# Altium project PCB_Smart_Garden.PrjPcb
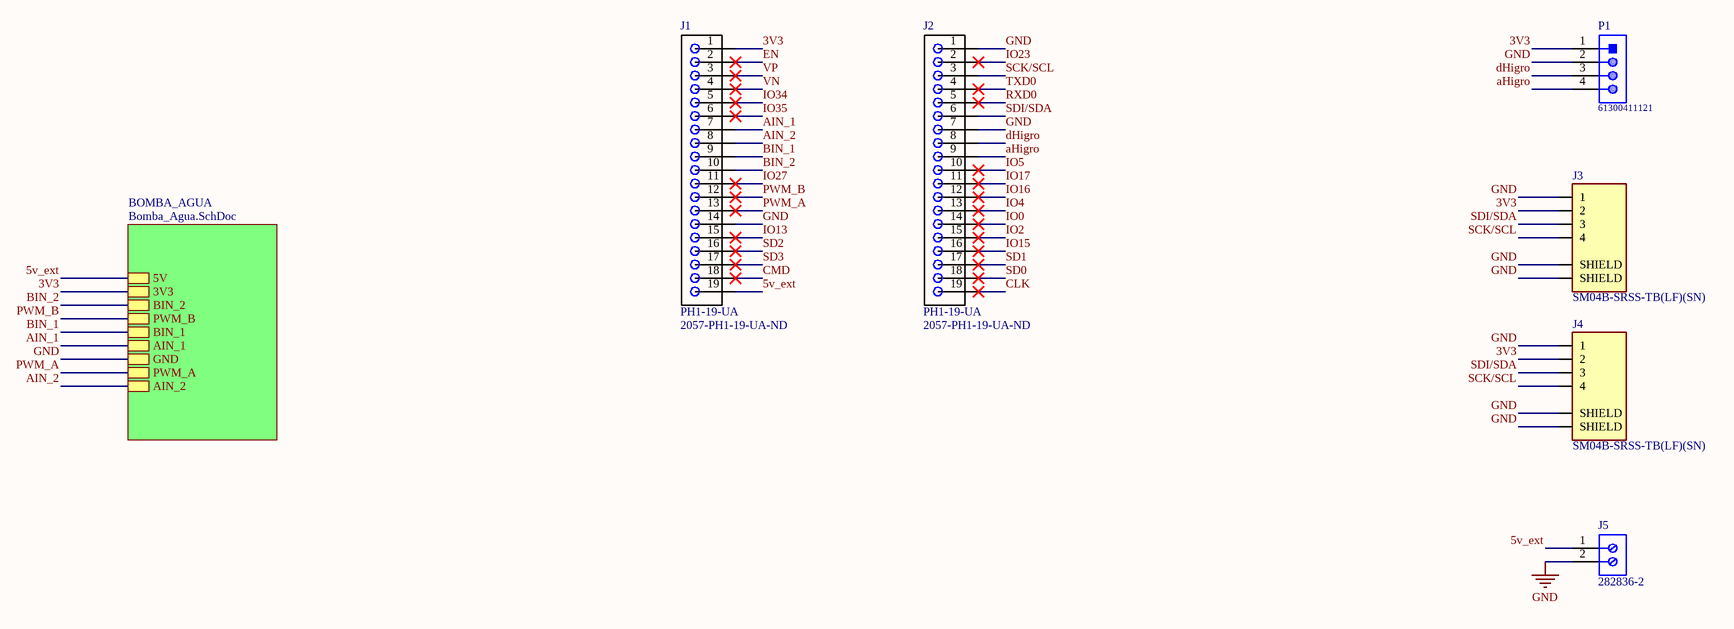
[diagram p0: SM_Balam_22.SchDoc]
2 sheets, 15 parts. Net scope: hierarchical (ports join the sheet entries above them; power ports are global).
Board file: PCB Smart Garden.PcbDoc
Sheets:
  SM_Balam_22.SchDoc
    BOMBA_AGUA = Bomba_Agua.SchDoc

## Sheet SM_Balam_22.SchDoc
size Tabloid; SheetNumber: 1; SheetTotal: 2

### Parts
J1  PH1-19-UA  Supplier Part Number 1: 2057-PH1-19-UA-ND  [PH1-19-UA - Socket]
J2  PH1-19-UA  Supplier Part Number 1: 2057-PH1-19-UA-ND  [PH1-19-UA - Socket]
J3  SM04B-SRSS-TB(LF)(SN)  [JST_SM04B-SRSS-TB(LF)(SN)]
J4  SM04B-SRSS-TB(LF)(SN)  [JST_SM04B-SRSS-TB(LF)(SN)]
J5  282836-2  [TECO-282836-2_V]
P1  61300411121  [61300411121]

### Sub-sheets
BOMBA_AGUA = Bomba_Agua.SchDoc: 5V, 3V3, BIN_2, PWM_B, BIN_1, AIN_1, GND, PWM_A, AIN_2

### Nets
GND: J1.14 J2.1 J2.7 J3.1 J3.S1(SHIELD) J3.S2(SHIELD) J4.1 J4.S1(SHIELD) J4.S2(SHIELD) J5.2 P1.2 ; sheet BOMBA_AGUA/GND
3V3: J1.1 J3.2 J4.2 P1.1 ; sheet BOMBA_AGUA/3V3
5v_ext: J1.19 J5.1 ; sheet BOMBA_AGUA/5V  [project net 5V]
aHigro: J2.9 P1.4
AIN_1: J1.7 ; sheet BOMBA_AGUA/AIN_1
AIN_2: J1.8 ; sheet BOMBA_AGUA/AIN_2
BIN_1: J1.9 ; sheet BOMBA_AGUA/BIN_1
BIN_2: J1.10 ; sheet BOMBA_AGUA/BIN_2
CLK: J2.19
CMD: J1.18
dHigro: J2.8 P1.3
EN: J1.2
IO0: J2.14
IO2: J2.15
IO4: J2.13
IO5: J2.10
IO13: J1.15
IO15: J2.16
IO16: J2.12
IO17: J2.11
IO23: J2.2
IO27: J1.11
IO34: J1.5
IO35: J1.6
PWM_A: J1.13 ; sheet BOMBA_AGUA/PWM_A
PWM_B: J1.12 ; sheet BOMBA_AGUA/PWM_B
RXD0: J2.5
SCK/SCL: J2.3 J3.4 J4.4
SD0: J2.18
SD1: J2.17
SD2: J1.16
SD3: J1.17
SDI/SDA: J2.6 J3.3 J4.3
TXD0: J2.4
VN: J1.4
VP: J1.3

### Library data of the parts
J1 J2 = PH1-19-UA: Connector Header Through Hole 19 position 0.100" (2.54mm); Supplier 1: Digi-Key
J3 J4 = SM04B-SRSS-TB(LF)(SN): Connector Header Surface Mount, Right Angle 4 position 0.039 _1.00mm_; MF: JST Sales; MP: SM04B-SRSS-TB_LF__SN_; Price: None; SnapEDA_Link: https://www.snapeda.com/parts/SM04B-SRSS-TB%28LF%29%28SN%29/JST%20Sales%20America%20Inc./view-part/557466/?ref=snap; Value: *; Availability: Unavailable; Package: None
J5 = CMP-1684-00017-1: Female Header, Pitch 5 mm, 1 x 2 Position, Height 10 mm, Tail Length 3.5 mm, Rohs, Bulk; Manufacturer: TE Connectivity; Wire Gauge: 16-30AWG; Product Training Modules: Wire-to-BoardEurostyleTerminalBlocks; Clamp Material - Plating: Brass-NickelPlated; Voltage: 300V; Mating Orientation: HorizontalwithBoard; Current: 13.5A; Pitch: 0.197"(5.00mm); Screw Thread: M3; 3D Model: 282836-2.pdf; Other Names: 5ULV-02B / A98076; Dynamic Catalog: BuchananSeries; Number of Levels: 1; Torque - Screw: 0.68Nm(6Lb-In); Featured Product: EurostyleTerminalBlockConnectors; Positions Per Level: 2; Wire Termination: Screw-RisingCageClamp; Datasheet URL: http://www.te.com.cn/commerce/DocumentDelivery/DDEController?Action=showdoc&DocId=Catalog+Section%7F1308389_EUROSTYLE_TERMINAL_BLOCKS%7F0607%7Fpdf%7FEnglish%7FENG_CS_1308389_EUROSTYLE_TERMINAL_BLOCKS_0607.pdf%7F282836-2; Color: Green; Family: TerminalBlocks-WiretoBoard; RoHS Information: 282836-2StatementofCompliance; Standard Package: 300; Contact Material - Plating: Brass-TinPlated; Manufacturer URL: http://www.te.com; Housing Material: Polyamide(PA66),Nylon6/6; Features: Interlocking(Side); Package Description: Female Header, Pitch 5 mm, 1 x 2 Position, Height 10 mm, Tail Length 3.5 mm; Mounting Type: ThroughHole; Package Reference: THD; Packaging: Bulk; Series: Buchanan; Category: Connectors,Interconnects; Screw Material - Plating: Brass-NickelPlated
P1 = CMP-1502-01064-1: THT Vertical Pin Header WR-PHD, Pitch 2.54 mm, Single Row, 4 pins; Manufacturer: Wurth Elektronik; Withstanding Voltage: 500VAC; Rated Current: 3A; Working Voltage: 250VAC; Pin Number: 4; Gender: Male; Contact Resistance: 20mOhm; Pitch: 2.54mm; Manufacturer URL: http://www.we-online.de; Operating Temperature: -40to105degC; Packaging: Bag; Mounting Technology: THT; Package Reference: 61300411121; Datasheet URL: https://katalog.we-online.de/em/datasheet/6130xx11121.pdf; Publisher: WurthElektronik; Part Number: 61300411121; Row Number: Single; Orientation: Vertical

## Sheet Bomba_Agua.SchDoc
size Tabloid; SheetNumber: 2; SheetTotal: 2
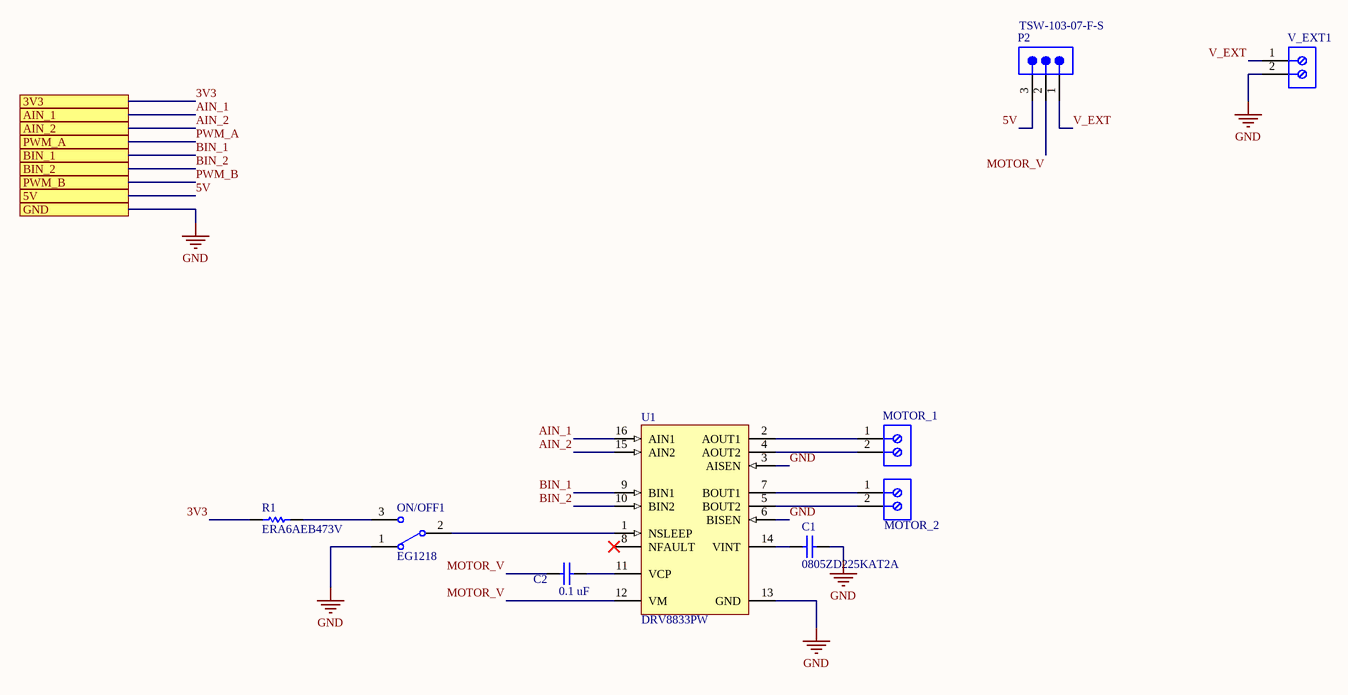
[diagram p1: Bomba_Agua.SchDoc]

### Parts
C1  0805ZD225KAT2A  [CAPC2013X140X50ML20T25]
C2  0.1 uF  [CAPC2013X94X50ML20T25]
MOTOR_1  691214110002  [691214110002]  (value not drawn)
MOTOR_2  691214110002  [691214110002]  (value not drawn)
ON/OFF1  EG1218  [ESWI-EG1218_V]
P2  TSW-103-07-F-S  [SMTC-TSW-103-07-X-S]
R1  ERA6AEB473V  [RESC2013X60X40ML20T25]
U1  DRV8833PW  [PW0016A_M]
V_EXT1  691214110002  [691214110002]  (value not drawn)

### Ports
3V3, 5V, AIN_1, AIN_2, BIN_1, BIN_2, GND, PWM_A, PWM_B

### Nets
GND: C1.2 ON/OFF1.1 U1.3(AISEN) U1.6(BISEN) U1.13(GND) V_EXT1.2 ; port GND
3V3: R1.2 ; port 3V3
5V: P2.3 ; port 5V
AIN_1: U1.16(AIN1) ; port AIN_1
AIN_2: U1.15(AIN2) ; port AIN_2
BIN_1: U1.9(BIN1) ; port BIN_1
BIN_2: U1.10(BIN2) ; port BIN_2
MOTOR_V: C2.2 P2.2 U1.12(VM)
V_EXT: P2.1 V_EXT1.1
NetC1_1: C1.1 U1.14(VINT)
NetC2_1: C2.1 U1.11(VCP)
NetMOTOR_1_1: MOTOR_1.1 U1.2(AOUT1)
NetMOTOR_1_2: MOTOR_1.2 U1.4(AOUT2)
NetMOTOR_2_1: MOTOR_2.1 U1.7(BOUT1)
NetMOTOR_2_2: MOTOR_2.2 U1.5(BOUT2)
NetON/OFF1_2: ON/OFF1.2(COM) U1.1(NSLEEP)
NetON/OFF1_3: ON/OFF1.3 R1.1

Not connected (* = marked no-connect by the designer): U1 8(NFAULT)*

### Library data of the parts
C1 = CMP-2000-05810-1: Chip Capacitor, 2.2 uF, +/- 10%, 10 V, -55 to 85 degC, 0805 (2012 Metric), RoHS, Tape and Reel; Manufacturer: AVX; Dielectric: X5R; Rated Voltage: 10V; Capacitance: 2.2µF; Tolerance (%): ±10%; Datasheet Version: 05/2016; Manufacturer URL: http://www.avx.com/; Package Description: 2-Pin Surface Mount Device, Body 2.01 x 1.25 mm; Mounting Technology: SurfaceMount; Case Size/Dimension: 0805; Package Reference: 0805; Datasheet URL: http://datasheets.avx.com/cx5r.pdf
C2 = CMP-2000-05016-1: Chip Capacitor, Ceramic, 0.1 uF, 10%, 50 V, 0805, RoHS, Tape and Reel; Manufacturer: AVX; Rated Voltage: 50V; Capacitance: 100nF; Dielectric: X7R; Case Size/Dimension: 0805; Tolerance (%): ±10%; Datasheet URL: http://www.farnell.com/datasheets/319609.pdf; Datasheet Version: Sep-07; Manufacturer URL: http://www.avx.com/
MOTOR_1 MOTOR_2 V_EXT1 = CMP-1502-02464-1: Serie 2141 - 3.50 mm Horizontal Entry Modular with Rising Cage Clamp WR-TBL, 2 pin; Manufacturer: Wurth Elektronik; Pin Number: 2; Pitch: 3.50mm; Datasheet URL: http://katalog.we-online.de/em/datasheet/6912141100xx.pdf; Packaging: Box; Mounting Technology: THT; Package Reference: 691214110002; Manufacturer URL: http://www.we-online.de; Part Number: 691214110002; Publisher: WurthElektronik; Operating Temperature: -40to105degC
ON/OFF1 = CMP-1696-00002-1: Slide Switch, 500 V, -20 to 70 degC, 3-Pin THD, RoHS; Case\Package: SOT-23-5; Output Current: 150 mA; Nominal Output Voltage: 3.3 V; Max Power Dissipation: 250 mW; Min Input Voltage: 4.3 V; Outputs: 1; Max Input Voltage: 8 V; Dropout Voltage: 300 mV; PackageDescription: 3-Pin Through Hole Device, Body 11.6 x 4 mm, Pitch 2.5 mm; ComponentLink1URL: http://www.e-switch.ch/en/; RoHSCompliant: true; Length: 3 mm; ComponentLink1Description: Manufacturer URL; Power Rating: 250 mW; Mount: Surface Mount; Max Operating Temperature: 85 degC; REACH SVHC: No SVHC; Radiation Hardening: No; Height: 1.3 mm; Pins: 5; Max Ouput Current: 150 mA; Output Voltage: 3.3 V; Width: 1.8 mm; Package Quantity: 3000; ComponentLink2URL: https://www.e-switch.com/system/asset/product_line/data_sheet/119/EG.pdf; Min Operating Temperature: -40 degC; ComponentLink2Description: Datasheet; DatasheetVersion: Oct-15; PackageReference: EG1218; Packaging: Tape and Reel
P2 = CMP-1024-00331-1: 0.025" SQ Post Header, Through-hole, Vertical, -55 to 125 degC, 2.54 mm Pitch, 3-Pin, Male, RoHS; Manufacturer: Samtec; Pitch: 2.54 mm; DatasheetVersion: F-214; ComponentLink1Description: Manufacturer URL; ComponentLink3URL: http://www.samtec.com/documents/webfiles/cpdf/TSW-XXX-XX-XXX-X-XX-XXX-MKT.pdf; Mounting Technology: Through-hole; PackageDescription: .025[0.64] SQ. Post Terminal Strip Assembly; Temperature Range: -55 to 125 degC; ComponentLink3Description: Package Specification; Orientation: Vertical; PartNumber: TSW-103-07-F-S; RoHS: True; PackageVersion: DM, 8/1988; ComponentLink2Description: Datasheet; ComponentLink1URL: http://www.samtec.com; ComponentLink2URL: http://www.samtec.com/documents/webfiles/pdf/TSW_TH.PDF; PackageReference: TSW-103-07-X-S
R1 = CMP-2001-00645-1: Manufacturer: Panasonic; Part Number: ERA6AEB473V
U1 = CMP-1529-00002-2: 2 A Low Voltage Dual Brushed DC or Single Bipolar Stepper Motor Driver (PWM Ctrl), 2.7 to 10.8 V, -40 to 85 degC, 16-Pin SOP (PW), Green (RoHS & no Sb/Br), Tube; Manufacturer: Texas Instruments; Peak Output Current: 2 A; RMS Output Current: 1.5 A; Vs: 2.7 V Min.; rDS (ON) (LS + HS): 360 mOhms; PackageVersion: 4040064-4/G; Temperature Range: -40 to 85 degC; ComponentLink2Description: Datasheet; Mounting Technology: Surface Mount; DatasheetVersion: SLVSAR1D; Control I/F: PWM; Eco-Plan: Green (RoHS & no Sb/Br); ComponentLink3URL: http://www.ti.com/lit/ml/mpds361/mpds361.pdf; ComponentLink1Description: Manufacturer URL; PartNumber: DRV8833PW; Package Reference: PW0016A; Packing: Tube; PackageDescription: 16-Pin Plastic Small Outline, Body 4.4 x 5 mm, Pitch 0.65 mm; ComponentLink3Description: Package Specification; ComponentLink1URL: www.ti.com; ComponentLink2URL: http://www.ti.com/lit/ds/symlink/drv8833.pdf

## Nets that join several sheets
GND: SM_Balam_22 (11 pins), Bomba_Agua (6 pins)
3V3: SM_Balam_22 (J1.1 J3.2 J4.2 P1.1), Bomba_Agua (R1.2)
5V: SM_Balam_22 (J1.19 J5.1), Bomba_Agua (P2.3)
AIN_1: SM_Balam_22 (J1.7), Bomba_Agua (U1.16)
AIN_2: SM_Balam_22 (J1.8), Bomba_Agua (U1.15)
BIN_1: SM_Balam_22 (J1.9), Bomba_Agua (U1.9)
BIN_2: SM_Balam_22 (J1.10), Bomba_Agua (U1.10)